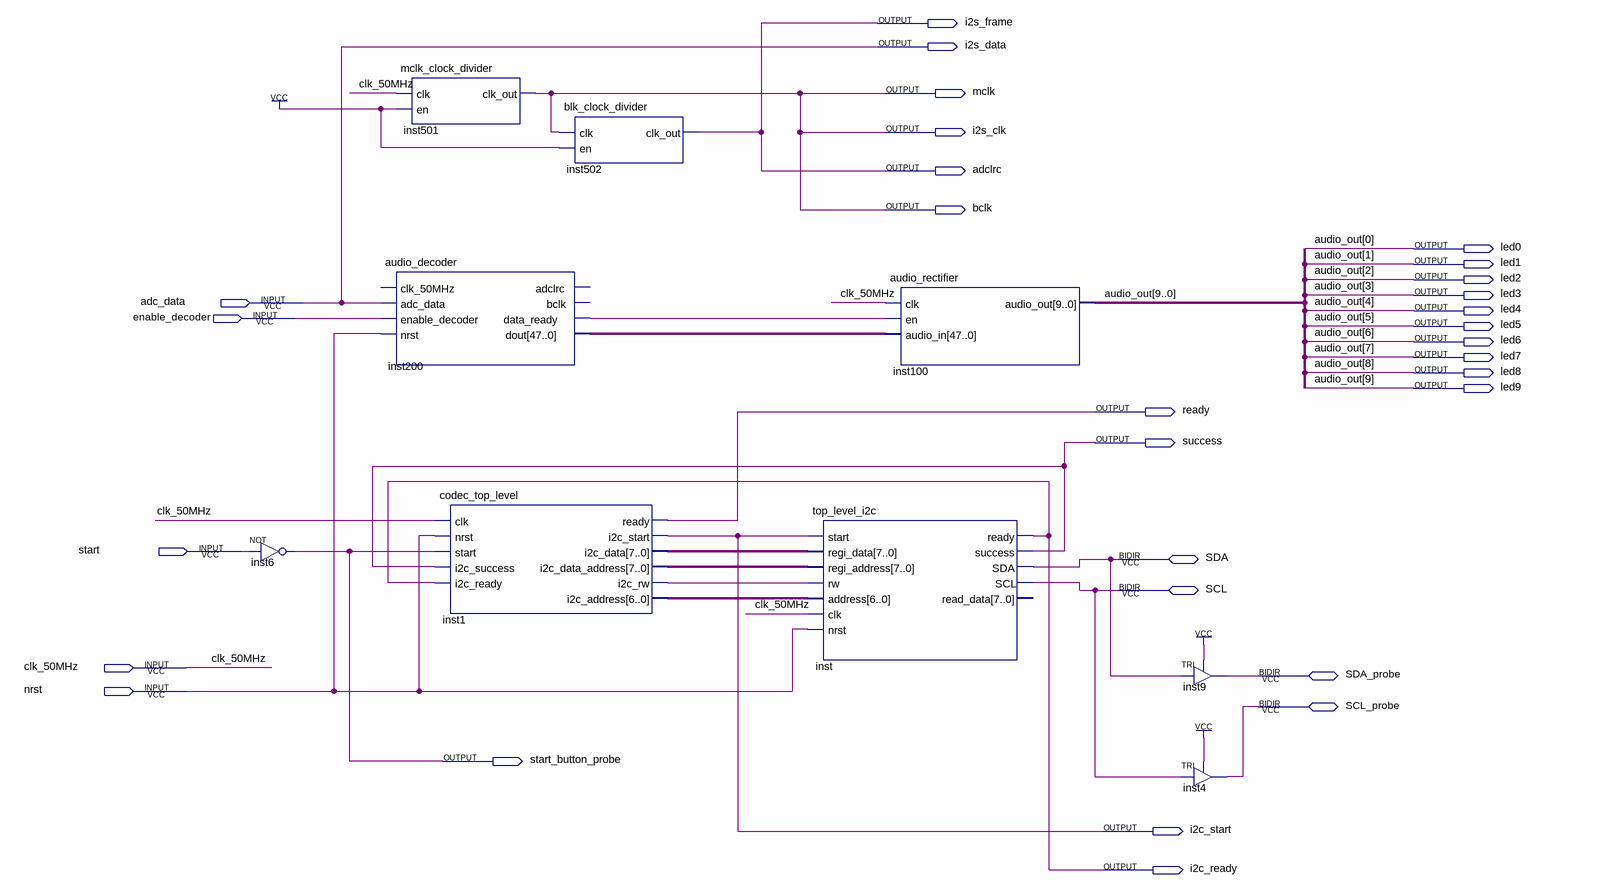
[diagram p0: schematic sheet]
// Quartus schematic i2c_configurator.bdf as structural Verilog: 9 symbols, 30 pins
module i2c_configurator (
  input  adc_data,
  input  enable_decoder,
  input  start,
  input  clk_50MHz,
  input  nrst,
  inout  SDA,
  inout  SCL,
  inout  SDA_probe,
  inout  SCL_probe,
  output i2s_frame,
  output i2s_data,
  output mclk,
  output i2s_clk,
  output adclrc,
  output bclk,
  output led0,
  output led1,
  output led2,
  output led3,
  output led4,
  output led5,
  output led6,
  output led7,
  output led8,
  output led9,
  output ready,
  output success,
  output start_button_probe,
  output i2c_start,
  output i2c_ready
);

  wire inst1_i2c_rw, inst200_data_ready;
  wire [6:0] inst1_i2c_address;
  wire [7:0] inst1_i2c_data, inst1_i2c_data_address;
  wire [47:0] inst200_dout;

  not inst6 (start_button_probe, start);
  audio_decoder inst200 (
    .adc_data(adc_data), .enable_decoder(enable_decoder), .nrst(nrst), .data_ready(inst200_data_ready),
    .dout(inst200_dout));  // open: clk_50MHz, adclrc, bclk
  mclk_clock_divider inst501 (.clk(clk_50MHz), .en(1'b1), .clk_out(bclk));
  codec_top_level inst1 (
    .clk(clk_50MHz), .nrst(nrst), .start(start_button_probe), .i2c_success(success), .i2c_ready(i2c_ready),
    .ready(ready), .i2c_start(i2c_start), .i2c_address(inst1_i2c_address), .i2c_rw(inst1_i2c_rw),
    .i2c_data(inst1_i2c_data), .i2c_data_address(inst1_i2c_data_address));
  blk_clock_divider inst502 (.clk(bclk), .en(1'b1), .clk_out(adclrc));
  top_level_i2c inst (
    .start(i2c_start), .regi_data(inst1_i2c_data), .regi_address(inst1_i2c_data_address), .rw(inst1_i2c_rw),
    .address(inst1_i2c_address), .clk(clk_50MHz), .nrst(nrst), .ready(i2c_ready), .success(success),
    .SDA(SDA), .SCL(SCL));  // open: read_data
  audio_rectifier inst100 (
    .clk(clk_50MHz), .en(inst200_data_ready), .audio_in(inst200_dout),
    .audio_out({led9, led8, led7, led6, led5, led4, led3, led2, led1, led0}));
  TRI inst9 (.IN(SDA), .OE(1'b1), .OUT(SDA_probe));
  TRI inst4 (.IN(SCL), .OE(1'b1), .OUT(SCL_probe));

  assign i2s_clk = bclk;
  assign i2s_data = adc_data;
  assign i2s_frame = adclrc;
  assign mclk = bclk;

  // Other names for the same wires on the sheet: audio_out[9:0] = {led9, led8, led7, led6, led5, led4, led3, led2, led1, led0}
endmodule
